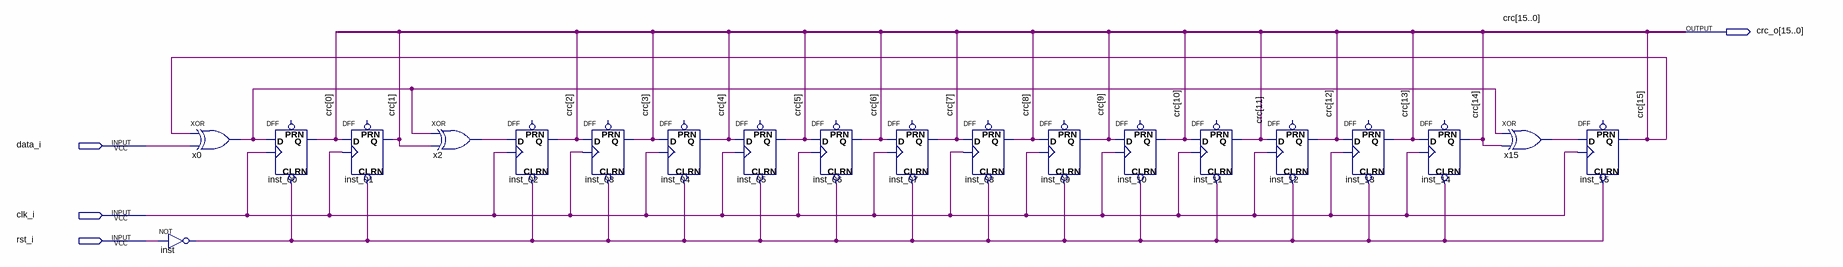
[diagram p0: schematic sheet]
// Quartus schematic crc16.bdf as structural Verilog: 20 symbols, 4 pins
module crc16 (
  input  data_i,
  input  clk_i,
  input  rst_i,
  output [15:0] crc_o
);

  wire inst_out, x0_out, x2_out, x15_out;

  xor x0 (x0_out, crc_o[15], data_i);
  not inst (inst_out, rst_i);
  DFF inst_00 (.CLRN(inst_out), .CLK(clk_i), .D(x0_out), .Q(crc_o[0]));  // open: PRN
  DFF inst_01 (.CLRN(inst_out), .CLK(clk_i), .D(crc_o[0]), .Q(crc_o[1]));  // open: PRN
  xor x2 (x2_out, x0_out, crc_o[1]);
  DFF inst_02 (.CLRN(inst_out), .CLK(clk_i), .D(x2_out), .Q(crc_o[2]));  // open: PRN
  DFF inst_03 (.CLRN(inst_out), .CLK(clk_i), .D(crc_o[2]), .Q(crc_o[3]));  // open: PRN
  DFF inst_04 (.CLRN(inst_out), .CLK(clk_i), .D(crc_o[3]), .Q(crc_o[4]));  // open: PRN
  DFF inst_05 (.CLRN(inst_out), .CLK(clk_i), .D(crc_o[4]), .Q(crc_o[5]));  // open: PRN
  DFF inst_06 (.CLRN(inst_out), .CLK(clk_i), .D(crc_o[5]), .Q(crc_o[6]));  // open: PRN
  DFF inst_07 (.CLRN(inst_out), .CLK(clk_i), .D(crc_o[6]), .Q(crc_o[7]));  // open: PRN
  DFF inst_08 (.CLRN(inst_out), .CLK(clk_i), .D(crc_o[7]), .Q(crc_o[8]));  // open: PRN
  DFF inst_09 (.CLRN(inst_out), .CLK(clk_i), .D(crc_o[8]), .Q(crc_o[9]));  // open: PRN
  DFF inst_10 (.CLRN(inst_out), .CLK(clk_i), .D(crc_o[9]), .Q(crc_o[10]));  // open: PRN
  DFF inst_11 (.CLRN(inst_out), .CLK(clk_i), .D(crc_o[10]), .Q(crc_o[11]));  // open: PRN
  DFF inst_12 (.CLRN(inst_out), .CLK(clk_i), .D(crc_o[11]), .Q(crc_o[12]));  // open: PRN
  DFF inst_13 (.CLRN(inst_out), .CLK(clk_i), .D(crc_o[12]), .Q(crc_o[13]));  // open: PRN
  DFF inst_14 (.CLRN(inst_out), .CLK(clk_i), .D(crc_o[13]), .Q(crc_o[14]));  // open: PRN
  xor x15 (x15_out, x0_out, crc_o[14]);
  DFF inst_15 (.CLRN(inst_out), .CLK(clk_i), .D(x15_out), .Q(crc_o[15]));  // open: PRN

  // Other names for the same wires on the sheet: crc[15:0] = crc_o
endmodule
